# Altium project LPC4357_SDRAM-BGA.PrjPcb
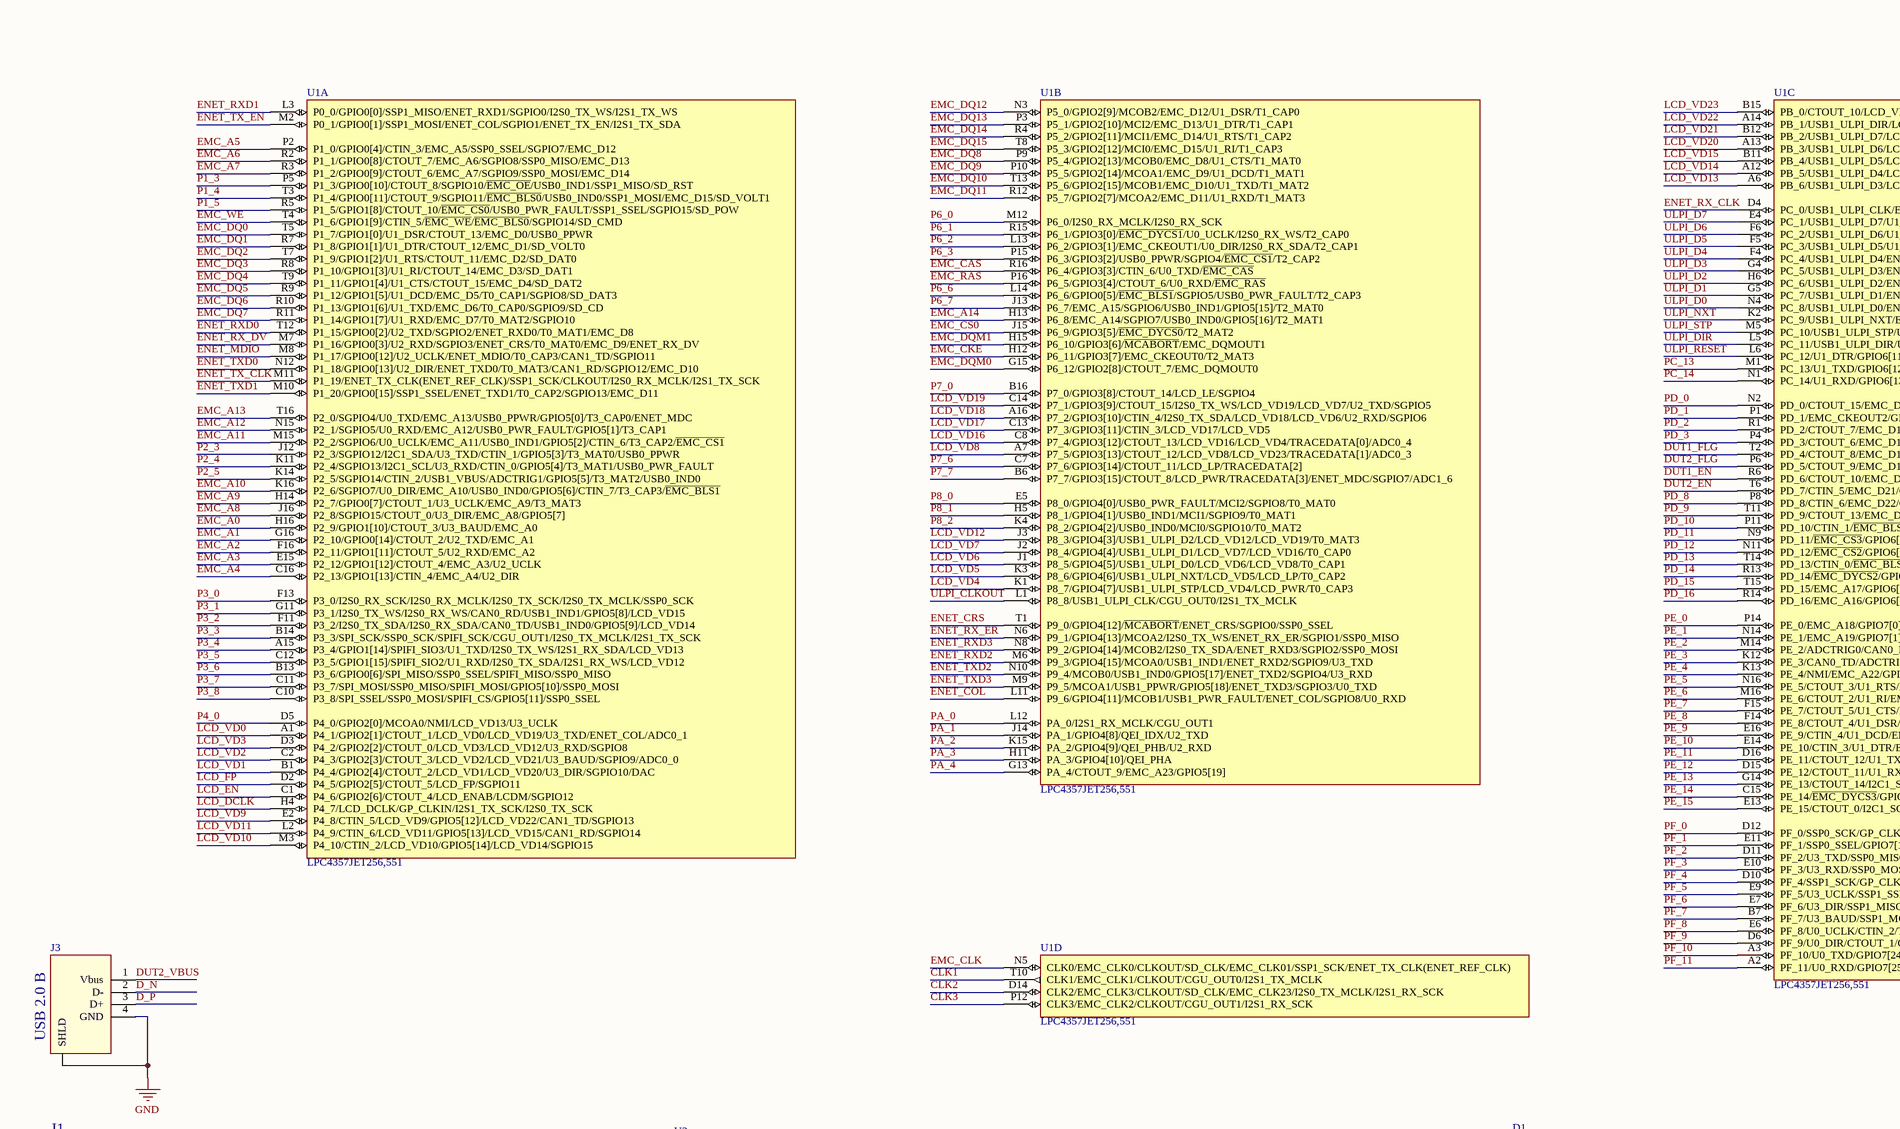
[diagram p0: LPC4357_SDRAM.SchDoc, top left]
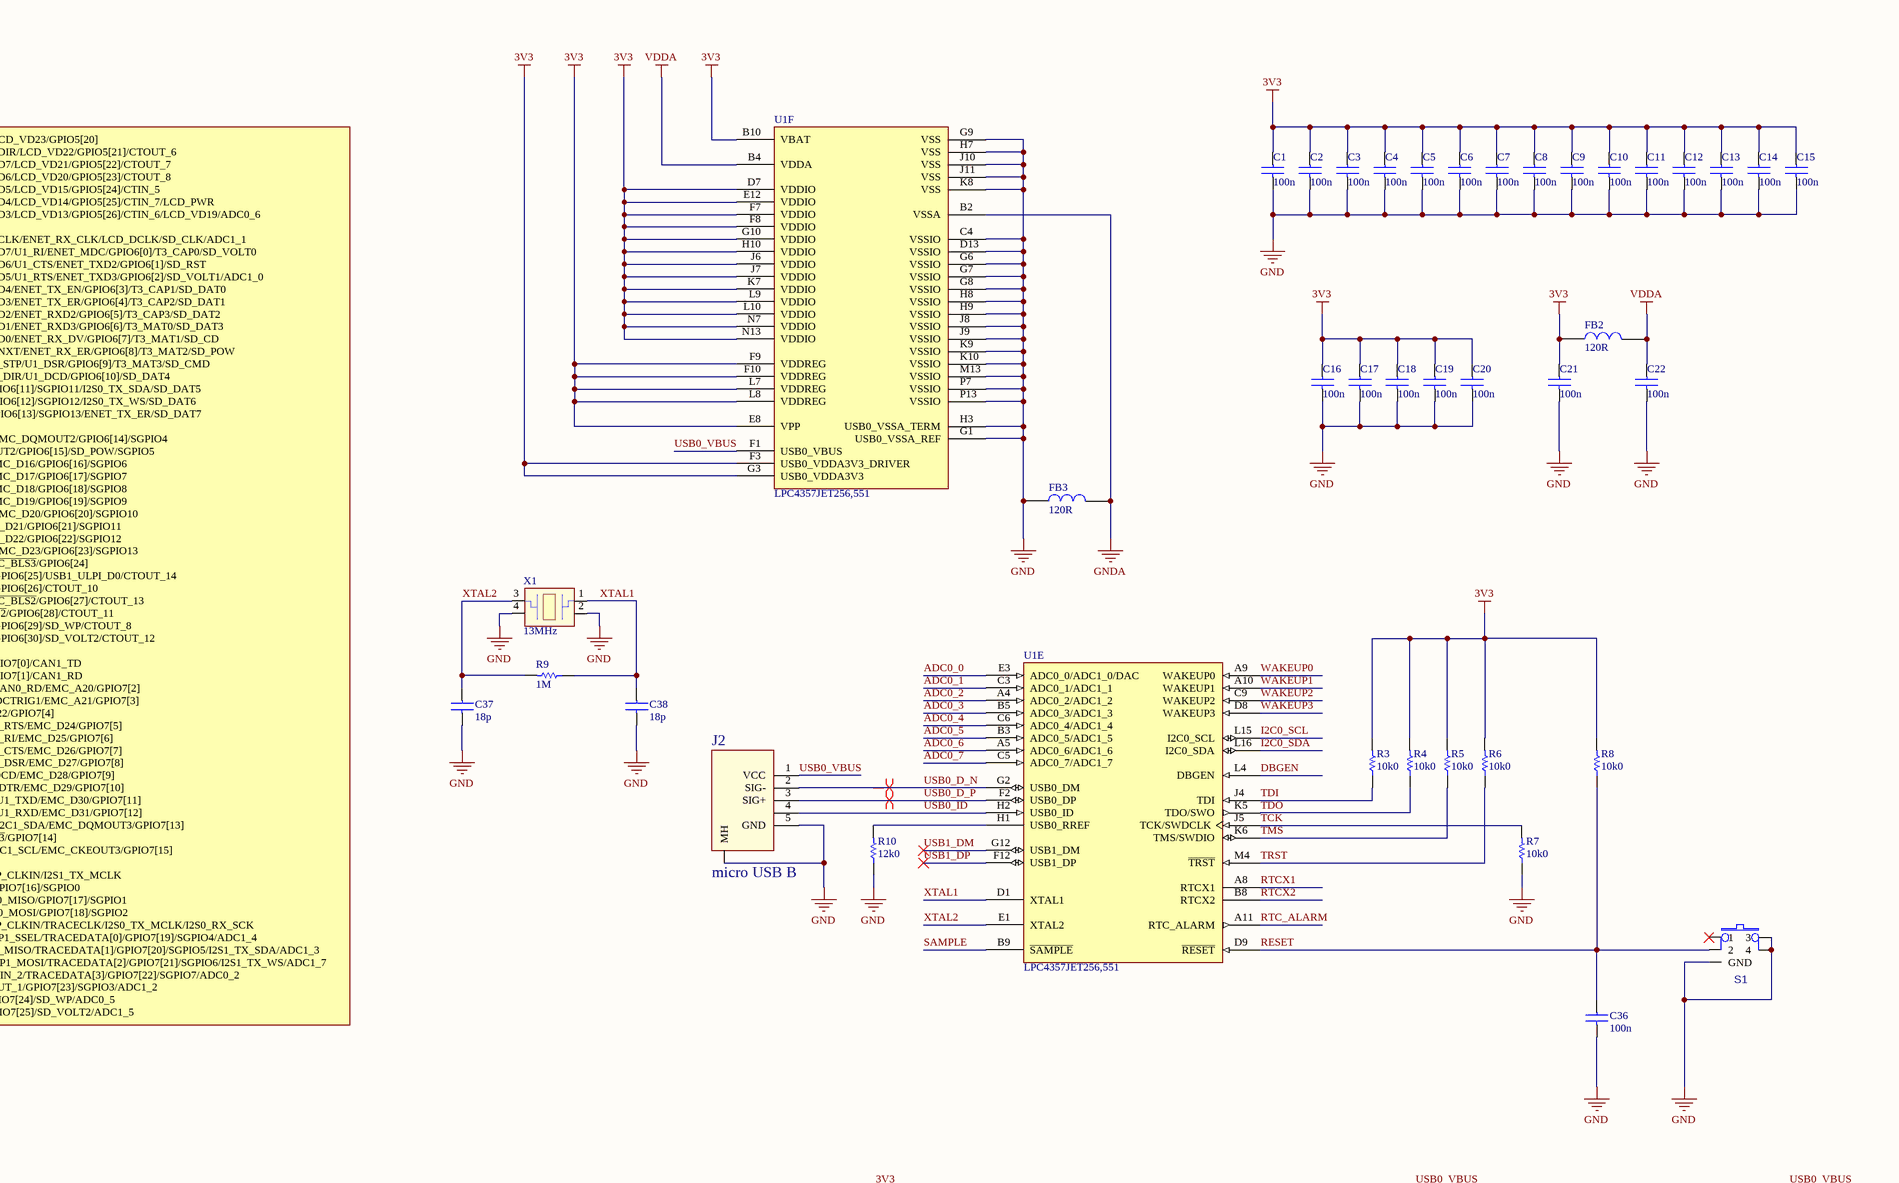
[diagram p1: LPC4357_SDRAM.SchDoc, top right]
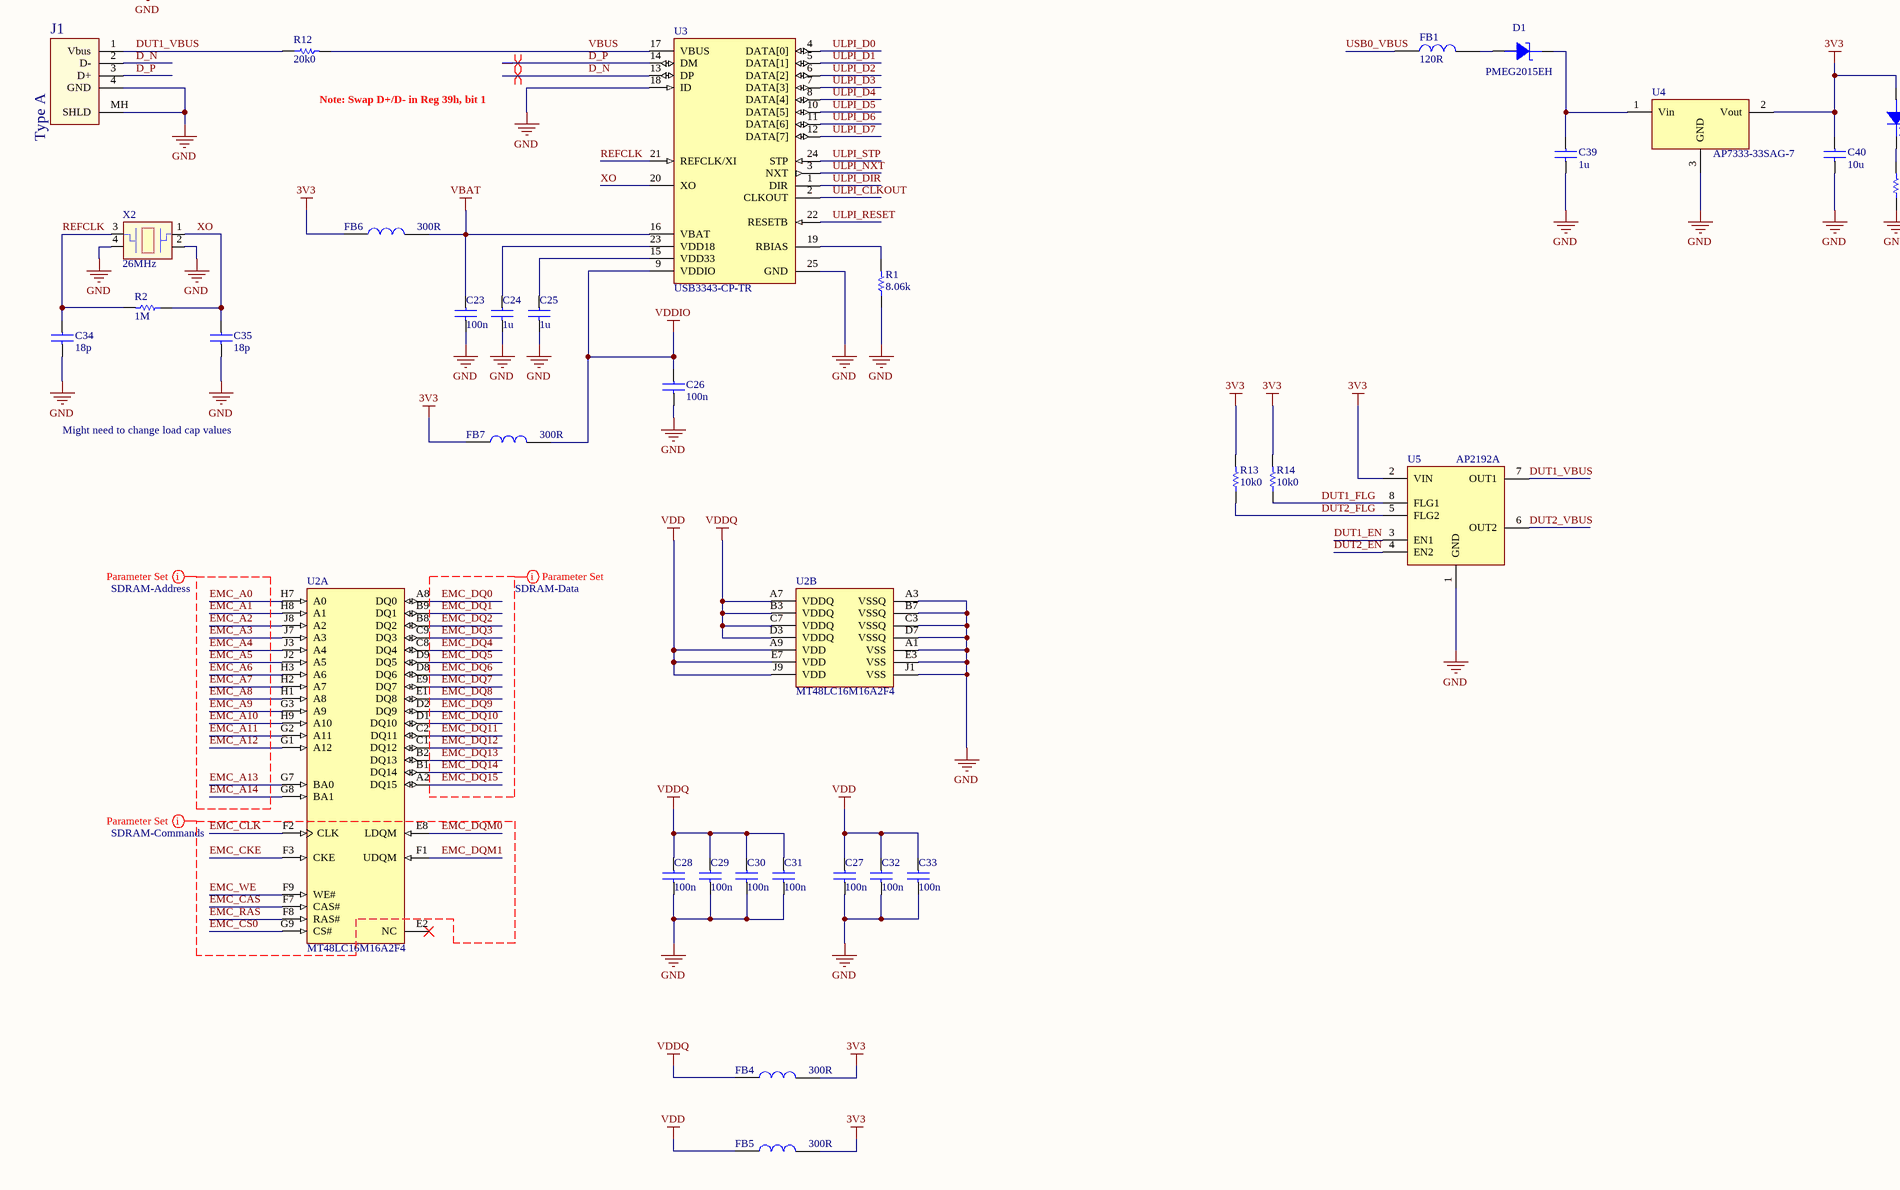
[diagram p2: LPC4357_SDRAM.SchDoc, bottom left]
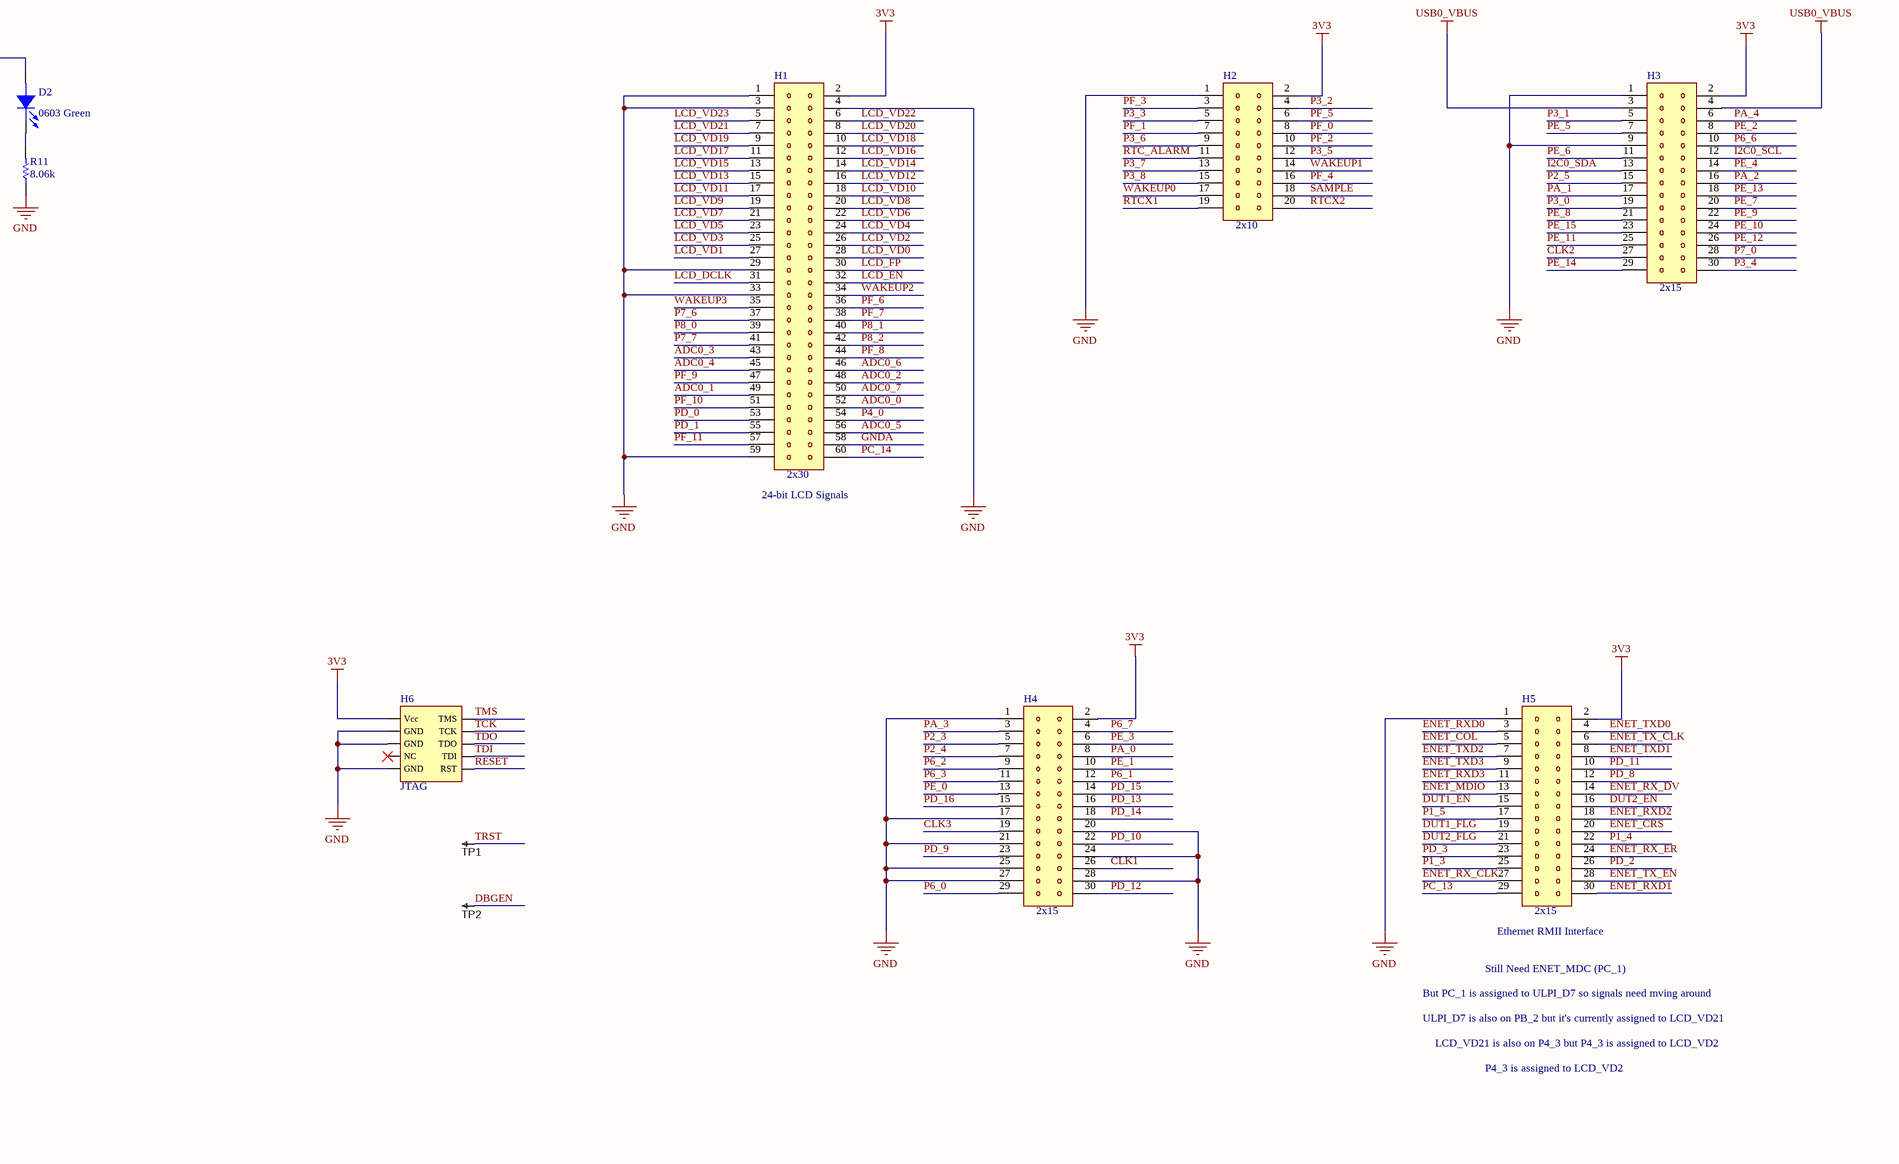
[diagram p3: LPC4357_SDRAM.SchDoc, bottom right]
1 sheet, 82 parts. Net scope: global (net labels, ports and power ports of the same name join across sheets).
Board file: LPC4357_SDRAM_v0.2.PcbDoc

## Sheet LPC4357_SDRAM.SchDoc
size D

### Parts
C1  100n  [C_0402_N]
C2  100n  [C_0402_N]
C3  100n  [C_0402_N]
C4  100n  [C_0402_N]
C5  100n  [C_0402_N]
C6  100n  [C_0402_N]
C7  100n  [C_0402_N]
C8  100n  [C_0402_N]
C9  100n  [C_0402_N]
C10  100n  [C_0402_N]
C11  100n  [C_0402_N]
C12  100n  [C_0402_N]
C13  100n  [C_0402_N]
C14  100n  [C_0402_N]
C15  100n  [C_0402_N]
C16  100n  [C_0402_N]
C17  100n  [C_0402_N]
C18  100n  [C_0402_N]
C19  100n  [C_0402_N]
C20  100n  [C_0402_N]
C21  100n  [C_0402_N]
C22  100n  [C_0402_N]
C23  100n  [C_0402_N]
C24  1u  [C_0402_N]
C25  1u  [C_0402_N]
C26  100n  [C_0402_N]
C27  100n  [C_0402_N]
C28  100n  [C_0402_N]
C29  100n  [C_0402_N]
C30  100n  [C_0402_N]
C31  100n  [C_0402_N]
C32  100n  [C_0402_N]
C33  100n  [C_0402_N]
C34  18p  [C_0402_N]
C35  18p  [C_0402_N]
C36  100n  [C_0402_N]
C37  18p  [C_0402_N]
C38  18p  [C_0402_N]
C39  1u  [C_0402_N]
C40  10u  [0603x55]
D1  PMEG2015EH  [SOD123F]
D2  0603 Green  [D_0603]
FB1  120R  [L_0603]
FB2  120R  [L_0603]
FB3  120R  [L_0603]
FB4  300R  [FB_0402-NIC]
FB5  300R  [FB_0402-NIC]
FB6  300R  [FB_0402-NIC]
FB7  300R  [FB_0402-NIC]
H1  2x30  [HDR_2x30_1.27mm]
H2  2x10  [HDR_2x10_1.27mm]
H3  2x15  [HDR_2x15_1.27mm]
H4  2x15  [HDR_2x15_1.27mm]
H5  2x15  [HDR_2x15_1.27mm]
H6  JTAG  [JTAG_FTSH-105-01-XXX-D-K]
J1  Type A  [USB_A_F_SIDE_REVERSE_TH]
J2  micro USB B  [10118194]
J3  USB 2.0 B  [USB_B_F_RA_TH]
R1  8.06k  [R_0402-N]
R2  1M  [R_0402-N]
R3  10k0  [R_0402-N]
R4  10k0  [R_0402-N]
R5  10k0  [R_0402-N]
R6  10k0  [R_0402-N]
R7  10k0  [R_0402-N]
R8  10k0  [R_0402-N]
R9  1M  [R_0402-N]
R10  12k0  [R_0402-N]
R11  8.06k  [R_0402-N]
R12  20k0  [R_0402-N]
R13  10k0  [R_0402-N]
R14  10k0  [R_0402-N]
S1  PTS840  [SW_PTS840]  (value not drawn)
TP1  TP_60mil-pad  [TP-R50]  (value not drawn)  (no BOM)
TP2  TP_60mil-pad  [TP-R50]  (value not drawn)  (no BOM)
U1  LPC4357JET256,551  [NXP-SOT740-2]  (parts A,B,C,D,E,F of 6)
U2  MT48LC16M16A2F4  [VFBGA54_8x8]  (parts A,B of 2)
U3  USB3343-CP-TR  [MCHP-QFN-24_A_V]
U4  AP7333-33SAG-7  [SOT23_N]
U5  AP2192A  [soic_8]
X1  13MHz  [XTAL_3.2mmx2.5mm]
X2  26MHz  [XTAL_2.0mmx1.6mm]

### Nets
3V3: C1.1 C2.1 C3.1 C4.1 C5.1 C6.1 C7.1 C8.1 C9.1 C10.1 C11.1 C12.1 C13.1 C14.1 C15.1 C16.1 C17.1 C18.1 C19.1 C20.1 C21.1 C40.1 D2.1(ANODE) FB2.1 FB4.2 FB5.2 FB6.1 FB7.1 H1.2 H2.2 H3.2 H4.2 H5.2 H6.1(Vcc) R3.2 R4.2 R5.2 R6.2 R8.2 R13.2 R14.2 U1.B10(VBAT) U1.D7(VDDIO) U1.E8(VPP) U1.E12(VDDIO) U1.F3(USB0_VDDA3V3_DRIVER) U1.F7(VDDIO) U1.F8(VDDIO) U1.F9(VDDREG) U1.F10(VDDREG) U1.G3(USB0_VDDA3V3) U1.G10(VDDIO) U1.H10(VDDIO) U1.J6(VDDIO) U1.J7(VDDIO) U1.K7(VDDIO) U1.L7(VDDREG) U1.L8(VDDREG) U1.L9(VDDIO) U1.L10(VDDIO) U1.N7(VDDIO) U1.N13(VDDIO) U4.2(Vout) U5.2(VIN)
GND: C1.2 C2.2 C3.2 C4.2 C5.2 C6.2 C7.2 C8.2 C9.2 C10.2 C11.2 C12.2 C13.2 C14.2 C15.2 C16.2 C17.2 C18.2 C19.2 C20.2 C21.2 C22.2 C23.2 C24.2 C25.2 C26.2 C27.2 C28.2 C29.2 C30.2 C31.2 C32.2 C33.2 C34.2 C35.2 C36.2 C37.2 C38.2 C39.2 C40.2 FB3.1 H1.1 H1.3 H1.4 H1.29 H1.33 H1.59 H2.1 H3.1 H3.9 H4.1 H4.17 H4.20 H4.21 H4.24 H4.25 H4.27 H4.28 H5.1 H6.3(GND) H6.5(GND) H6.9(GND) J1.4(GND) J1.MH(SHLD) J2.5(GND) J2.MH J3.4(GND) J3.SH(SHLD) R1.1 R7.1 R10.1 R11.1 S1.3 S1.4 S1.5(GND) U1.C4(VSSIO) U1.D13(VSSIO) U1.G1(USB0_VSSA_REF) U1.G6(VSSIO) U1.G7(VSSIO) U1.G8(VSSIO) U1.G9(VSS) U1.H3(USB0_VSSA_TERM) U1.H7(VSS) U1.H8(VSSIO) U1.H9(VSSIO) U1.J8(VSSIO) U1.J9(VSSIO) U1.J10(VSS) U1.J11(VSS) U1.K8(VSS) U1.K9(VSSIO) U1.K10(VSSIO) U1.M13(VSSIO) U1.P7(VSSIO) U1.P13(VSSIO) U2.A1(VSS) U2.A3(VSSQ) U2.B7(VSSQ) U2.C3(VSSQ) U2.D7(VSSQ) U2.E3(VSS) U2.J1(VSS) U3.18(ID) U3.25(GND) U4.3(GND) U5.1(GND) X1.2(GND) X1.4(GND) X2.2(GND) X2.4(GND)
GNDA: FB3.2 H1.58 U1.B2(VSSA)
USB0_VBUS: FB1.1 H3.3 H3.4 J2.1(VCC) U1.F1(USB0_VBUS)
VBAT: C23.1 FB6.2 U3.16(VBAT)
VDD: C27.1 C32.1 C33.1 FB5.1 U2.A9(VDD) U2.E7(VDD) U2.J9(VDD)
VDDA: C22.1 FB2.2 U1.B4(VDDA)
VDDIO: C26.1 FB7.2 U3.9(VDDIO)
VDDQ: C28.1 C29.1 C30.1 C31.1 FB4.1 U2.A7(VDDQ) U2.B3(VDDQ) U2.C7(VDDQ) U2.D3(VDDQ)
ADC0_0: H1.52 U1.E3(ADC0_0/ADC1_0/DAC)
ADC0_1: H1.49 U1.C3(ADC0_1/ADC1_1)
ADC0_2: H1.48 U1.A4(ADC0_2/ADC1_2)
ADC0_3: H1.43 U1.B5(ADC0_3/ADC1_3)
ADC0_4: H1.45 U1.C6(ADC0_4/ADC1_4)
ADC0_5: H1.56 U1.B3(ADC0_5/ADC1_5)
ADC0_6: H1.46 U1.A5(ADC0_6/ADC1_6)
ADC0_7: H1.50 U1.C5(ADC0_7/ADC1_7)
CLK1: H4.26 U1.T10(CLK1/EMC_CLK1/CLKOUT/CGU_OUT0/I2S1_TX_MCLK)
CLK2: H3.27 U1.D14(CLK2/EMC_CLK3/CLKOUT/SD_CLK/EMC_CLK23/I2S0_TX_MCLK/I2S1_RX_SCK)
CLK3: H4.19 U1.P12(CLK3/EMC_CLK2/CLKOUT/CGU_OUT1/I2S1_RX_SCK)
D_N: J1.2(D-) J3.2(D-) U3.13(DP)
D_P: J1.3(D+) J3.3(D+) U3.14(DM)
DBGEN: TP2.1 U1.L4(DBGEN)
DUT1_EN: H5.15 U1.R6(PD_6/CTOUT_10/EMC_D20/GPIO6[20]/SGPIO10) U5.3(EN1)
DUT1_FLG: H5.19 R14.1 U1.T2(PD_4/CTOUT_8/EMC_D18/GPIO6[18]/SGPIO8) U5.8(FLG1)
DUT1_VBUS: J1.1(Vbus) R12.1 U5.7(OUT1)
DUT2_EN: H5.16 U1.T6(PD_7/CTIN_5/EMC_D21/GPIO6[21]/SGPIO11) U5.4(EN2)
DUT2_FLG: H5.21 R13.1 U1.P6(PD_5/CTOUT_9/EMC_D19/GPIO6[19]/SGPIO9) U5.5(FLG2)
DUT2_VBUS: J3.1(Vbus) U5.6(OUT2)
EMC_A0: U1.H16(P2_9/GPIO1[10]/CTOUT_3/U3_BAUD/EMC_A0) U2.H7(A0)
EMC_A1: U1.G16(P2_10/GPIO0[14]/CTOUT_2/U2_TXD/EMC_A1) U2.H8(A1)
EMC_A2: U1.F16(P2_11/GPIO1[11]/CTOUT_5/U2_RXD/EMC_A2) U2.J8(A2)
EMC_A3: U1.E15(P2_12/GPIO1[12]/CTOUT_4/EMC_A3/U2_UCLK) U2.J7(A3)
EMC_A4: U1.C16(P2_13/GPIO1[13]/CTIN_4/EMC_A4/U2_DIR) U2.J3(A4)
EMC_A5: U1.P2(P1_0/GPIO0[4]/CTIN_3/EMC_A5/SSP0_SSEL/SGPIO7/EMC_D12) U2.J2(A5)
EMC_A6: U1.R2(P1_1/GPIO0[8]/CTOUT_7/EMC_A6/SGPIO8/SSP0_MISO/EMC_D13) U2.H3(A6)
EMC_A7: U1.R3(P1_2/GPIO0[9]/CTOUT_6/EMC_A7/SGPIO9/SSP0_MOSI/EMC_D14) U2.H2(A7)
EMC_A8: U1.J16(P2_8/SGPIO15/CTOUT_0/U3_DIR/EMC_A8/GPIO5[7]) U2.H1(A8)
EMC_A9: U1.H14(P2_7/GPIO0[7]/CTOUT_1/U3_UCLK/EMC_A9/T3_MAT3) U2.G3(A9)
EMC_A10: U1.K16(P2_6/SGPIO7/U0_DIR/EMC_A10/USB0_IND0/GPIO5[6]/CTIN_7/T3_CAP3/~{EMC_BLS1}) U2.H9(A10)
EMC_A11: U1.M15(P2_2/SGPIO6/U0_UCLK/EMC_A11/USB0_IND1/GPIO5[2]/CTIN_6/T3_CAP2/~{EMC_CS1}) U2.G2(A11)
EMC_A12: U1.N15(P2_1/SGPIO5/U0_RXD/EMC_A12/USB0_PWR_FAULT/GPIO5[1]/T3_CAP1) U2.G1(A12)
EMC_A13: U1.T16(P2_0/SGPIO4/U0_TXD/EMC_A13/USB0_PPWR/GPIO5[0]/T3_CAP0/ENET_MDC) U2.G7(BA0)
EMC_A14: U1.H13(P6_8/EMC_A14/SGPIO7/USB0_IND0/GPIO5[16]/T2_MAT1) U2.G8(BA1)
EMC_CAS: U1.R16(P6_4/GPIO3[3]/CTIN_6/U0_TXD/~{EMC_CAS}) U2.F7(CAS#)
EMC_CKE: U1.H12(P6_11/GPIO3[7]/EMC_CKEOUT0/T2_MAT3) U2.F3(CKE)
EMC_CLK: U1.N5(CLK0/EMC_CLK0/CLKOUT/SD_CLK/EMC_CLK01/SSP1_SCK/ENET_TX_CLK(ENET_REF_CLK)) U2.F2(CLK)
EMC_CS0: U1.J15(P6_9/GPIO3[5]/~{EMC_DYCS0}/T2_MAT2) U2.G9(CS#)
EMC_DQ0: U1.T5(P1_7/GPIO1[0]/U1_DSR/CTOUT_13/EMC_D0/USB0_PPWR) U2.A8(DQ0)
EMC_DQ1: U1.R7(P1_8/GPIO1[1]/U1_DTR/CTOUT_12/EMC_D1/SD_VOLT0) U2.B9(DQ1)
EMC_DQ2: U1.T7(P1_9/GPIO1[2]/U1_RTS/CTOUT_11/EMC_D2/SD_DAT0) U2.B8(DQ2)
EMC_DQ3: U1.R8(P1_10/GPIO1[3]/U1_RI/CTOUT_14/EMC_D3/SD_DAT1) U2.C9(DQ3)
EMC_DQ4: U1.T9(P1_11/GPIO1[4]/U1_CTS/CTOUT_15/EMC_D4/SD_DAT2) U2.C8(DQ4)
EMC_DQ5: U1.R9(P1_12/GPIO1[5]/U1_DCD/EMC_D5/T0_CAP1/SGPIO8/SD_DAT3) U2.D9(DQ5)
EMC_DQ6: U1.R10(P1_13/GPIO1[6]/U1_TXD/EMC_D6/T0_CAP0/SGPIO9/SD_CD) U2.D8(DQ6)
EMC_DQ7: U1.R11(P1_14/GPIO1[7]/U1_RXD/EMC_D7/T0_MAT2/SGPIO10) U2.E9(DQ7)
EMC_DQ8: U1.P9(P5_4/GPIO2[13]/MCOB0/EMC_D8/U1_CTS/T1_MAT0) U2.E1(DQ8)
EMC_DQ9: U1.P10(P5_5/GPIO2[14]/MCOA1/EMC_D9/U1_DCD/T1_MAT1) U2.D2(DQ9)
EMC_DQ10: U1.T13(P5_6/GPIO2[15]/MCOB1/EMC_D10/U1_TXD/T1_MAT2) U2.D1(DQ10)
EMC_DQ11: U1.R12(P5_7/GPIO2[7]/MCOA2/EMC_D11/U1_RXD/T1_MAT3) U2.C2(DQ11)
EMC_DQ12: U1.N3(P5_0/GPIO2[9]/MCOB2/EMC_D12/U1_DSR/T1_CAP0) U2.C1(DQ12)
EMC_DQ13: U1.P3(P5_1/GPIO2[10]/MCI2/EMC_D13/U1_DTR/T1_CAP1) U2.B2(DQ13)
EMC_DQ14: U1.R4(P5_2/GPIO2[11]/MCI1/EMC_D14/U1_RTS/T1_CAP2) U2.B1(DQ14)
EMC_DQ15: U1.T8(P5_3/GPIO2[12]/MCI0/EMC_D15/U1_RI/T1_CAP3) U2.A2(DQ15)
EMC_DQM0: U1.G15(P6_12/GPIO2[8]/CTOUT_7/EMC_DQMOUT0) U2.E8(LDQM)
EMC_DQM1: U1.H15(P6_10/GPIO3[6]/~{MCABORT}/EMC_DQMOUT1) U2.F1(UDQM)
EMC_RAS: U1.P16(P6_5/GPIO3[4]/CTOUT_6/U0_RXD/~{EMC_RAS}) U2.F8(RAS#)
EMC_WE: U1.T4(P1_6/GPIO1[9]/CTIN_5/~{EMC_WE}/~{EMC_BLS0}/SGPIO14/SD_CMD) U2.F9(WE#)
ENET_COL: H5.5 U1.L11(P9_6/GPIO4[11]/MCOB1/USB1_PWR_FAULT/ENET_COL/SGPIO8/U0_RXD)
ENET_CRS: H5.20 U1.T1(P9_0/GPIO4[12]/~{MCABORT}/ENET_CRS/SGPIO0/SSP0_SSEL)
ENET_MDIO: H5.13 U1.M8(P1_17/GPIO0[12]/U2_UCLK/ENET_MDIO/T0_CAP3/CAN1_TD/SGPIO11)
ENET_RX_CLK: H5.27 U1.D4(PC_0/USB1_ULPI_CLK/ENET_RX_CLK/LCD_DCLK/SD_CLK/ADC1_1)
ENET_RX_DV: H5.14 U1.M7(P1_16/GPIO0[3]/U2_RXD/SGPIO3/ENET_CRS/T0_MAT0/EMC_D9/ENET_RX_DV)
ENET_RX_ER: H5.24 U1.N6(P9_1/GPIO4[13]/MCOA2/I2S0_TX_WS/ENET_RX_ER/SGPIO1/SSP0_MISO)
ENET_RXD0: H5.3 U1.T12(P1_15/GPIO0[2]/U2_TXD/SGPIO2/ENET_RXD0/T0_MAT1/EMC_D8)
ENET_RXD1: H5.30 U1.L3(P0_0/GPIO0[0]/SSP1_MISO/ENET_RXD1/SGPIO0/I2S0_TX_WS/I2S1_TX_WS)
ENET_RXD2: H5.18 U1.M6(P9_3/GPIO4[15]/MCOA0/USB1_IND1/ENET_RXD2/SGPIO9/U3_TXD)
ENET_RXD3: H5.11 U1.N8(P9_2/GPIO4[14]/MCOB2/I2S0_TX_SDA/ENET_RXD3/SGPIO2/SSP0_MOSI)
ENET_TX_CLK: H5.6 U1.M11(P1_19/ENET_TX_CLK(ENET_REF_CLK)/SSP1_SCK/CLKOUT/I2S0_RX_MCLK/I2S1_TX_SCK)
ENET_TX_EN: H5.28 U1.M2(P0_1/GPIO0[1]/SSP1_MOSI/ENET_COL/SGPIO1/ENET_TX_EN/I2S1_TX_SDA)
ENET_TXD0: H5.4 U1.N12(P1_18/GPIO0[13]/U2_DIR/ENET_TXD0/T0_MAT3/CAN1_RD/SGPIO12/EMC_D10)
ENET_TXD1: H5.8 U1.M10(P1_20/GPIO0[15]/SSP1_SSEL/ENET_TXD1/T0_CAP2/SGPIO13/EMC_D11)
ENET_TXD2: H5.7 U1.N10(P9_4/MCOB0/USB1_IND0/GPIO5[17]/ENET_TXD2/SGPIO4/U3_RXD)
ENET_TXD3: H5.9 U1.M9(P9_5/MCOA1/USB1_PPWR/GPIO5[18]/ENET_TXD3/SGPIO3/U0_TXD)
I2C0_SCL: H3.12 U1.L15(I2C0_SCL)
I2C0_SDA: H3.13 U1.L16(I2C0_SDA)
LCD_DCLK: H1.31 U1.H4(P4_7/LCD_DCLK/GP_CLKIN/I2S1_TX_SCK/I2S0_TX_SCK)
LCD_EN: H1.32 U1.C1(P4_6/GPIO2[6]/CTOUT_4/LCD_ENAB/LCDM/SGPIO12)
LCD_FP: H1.30 U1.D2(P4_5/GPIO2[5]/CTOUT_5/LCD_FP/SGPIO11)
LCD_VD0: H1.28 U1.A1(P4_1/GPIO2[1]/CTOUT_1/LCD_VD0/LCD_VD19/U3_TXD/ENET_COL/ADC0_1)
LCD_VD1: H1.27 U1.B1(P4_4/GPIO2[4]/CTOUT_2/LCD_VD1/LCD_VD20/U3_DIR/SGPIO10/DAC)
LCD_VD2: H1.26 U1.C2(P4_3/GPIO2[3]/CTOUT_3/LCD_VD2/LCD_VD21/U3_BAUD/SGPIO9/ADC0_0)
LCD_VD3: H1.25 U1.D3(P4_2/GPIO2[2]/CTOUT_0/LCD_VD3/LCD_VD12/U3_RXD/SGPIO8)
LCD_VD4: H1.24 U1.K1(P8_7/GPIO4[7]/USB1_ULPI_STP/LCD_VD4/LCD_PWR/T0_CAP3)
LCD_VD5: H1.23 U1.K3(P8_6/GPIO4[6]/USB1_ULPI_NXT/LCD_VD5/LCD_LP/T0_CAP2)
LCD_VD6: H1.22 U1.J1(P8_5/GPIO4[5]/USB1_ULPI_D0/LCD_VD6/LCD_VD8/T0_CAP1)
LCD_VD7: H1.21 U1.J2(P8_4/GPIO4[4]/USB1_ULPI_D1/LCD_VD7/LCD_VD16/T0_CAP0)
LCD_VD8: H1.20 U1.A7(P7_5/GPIO3[13]/CTOUT_12/LCD_VD8/LCD_VD23/TRACEDATA[1]/ADC0_3)
LCD_VD9: H1.19 U1.E2(P4_8/CTIN_5/LCD_VD9/GPIO5[12]/LCD_VD22/CAN1_TD/SGPIO13)
LCD_VD10: H1.18 U1.M3(P4_10/CTIN_2/LCD_VD10/GPIO5[14]/LCD_VD14/SGPIO15)
LCD_VD11: H1.17 U1.L2(P4_9/CTIN_6/LCD_VD11/GPIO5[13]/LCD_VD15/CAN1_RD/SGPIO14)
LCD_VD12: H1.16 U1.J3(P8_3/GPIO4[3]/USB1_ULPI_D2/LCD_VD12/LCD_VD19/T0_MAT3)
LCD_VD13: H1.15 U1.A6(PB_6/USB1_ULPI_D3/LCD_VD13/GPIO5[26]/CTIN_6/LCD_VD19/ADC0_6)
LCD_VD14: H1.14 U1.A12(PB_5/USB1_ULPI_D4/LCD_VD14/GPIO5[25]/CTIN_7/LCD_PWR)
LCD_VD15: H1.13 U1.B11(PB_4/USB1_ULPI_D5/LCD_VD15/GPIO5[24]/CTIN_5)
LCD_VD16: H1.12 U1.C8(P7_4/GPIO3[12]/CTOUT_13/LCD_VD16/LCD_VD4/TRACEDATA[0]/ADC0_4)
LCD_VD17: H1.11 U1.C13(P7_3/GPIO3[11]/CTIN_3/LCD_VD17/LCD_VD5)
LCD_VD18: H1.10 U1.A16(P7_2/GPIO3[10]/CTIN_4/I2S0_TX_SDA/LCD_VD18/LCD_VD6/U2_RXD/SGPIO6)
LCD_VD19: H1.9 U1.C14(P7_1/GPIO3[9]/CTOUT_15/I2S0_TX_WS/LCD_VD19/LCD_VD7/U2_TXD/SGPIO5)
LCD_VD20: H1.8 U1.A13(PB_3/USB1_ULPI_D6/LCD_VD20/GPIO5[23]/CTOUT_8)
LCD_VD21: H1.7 U1.B12(PB_2/USB1_ULPI_D7/LCD_VD21/GPIO5[22]/CTOUT_7)
LCD_VD22: H1.6 U1.A14(PB_1/USB1_ULPI_DIR/LCD_VD22/GPIO5[21]/CTOUT_6)
LCD_VD23: H1.5 U1.B15(PB_0/CTOUT_10/LCD_VD23/GPIO5[20])
P1_3: H5.25 U1.P5(P1_3/GPIO0[10]/CTOUT_8/SGPIO10/~{EMC_OE}/USB0_IND1/SSP1_MISO/SD_RST)
P1_4: H5.22 U1.T3(P1_4/GPIO0[11]/CTOUT_9/SGPIO11/~{EMC_BLS0}/USB0_IND0/SSP1_MOSI/EMC_D15/SD_VOLT1)
P1_5: H5.17 U1.R5(P1_5/GPIO1[8]/CTOUT_10/~{EMC_CS0}/USB0_PWR_FAULT/SSP1_SSEL/SGPIO15/SD_POW)
P2_3: H4.5 U1.J12(P2_3/SGPIO12/I2C1_SDA/U3_TXD/CTIN_1/GPIO5[3]/T3_MAT0/USB0_PPWR)
P2_4: H4.7 U1.K11(P2_4/SGPIO13/I2C1_SCL/U3_RXD/CTIN_0/GPIO5[4]/T3_MAT1/USB0_PWR_FAULT)
P2_5: H3.15 U1.K14(P2_5/SGPIO14/CTIN_2/USB1_VBUS/ADCTRIG1/GPIO5[5]/T3_MAT2/USB0_IND0)
P3_0: H3.19 U1.F13(P3_0/I2S0_RX_SCK/I2S0_RX_MCLK/I2S0_TX_SCK/I2S0_TX_MCLK/SSP0_SCK)
P3_1: H3.5 U1.G11(P3_1/I2S0_TX_WS/I2S0_RX_WS/CAN0_RD/USB1_IND1/GPIO5[8]/LCD_VD15)
P3_2: H2.4 U1.F11(P3_2/I2S0_TX_SDA/I2S0_RX_SDA/CAN0_TD/USB1_IND0/GPIO5[9]/LCD_VD14)
P3_3: H2.5 U1.B14(P3_3/SPI_SCK/SSP0_SCK/SPIFI_SCK/CGU_OUT1/I2S0_TX_MCLK/I2S1_TX_SCK)
P3_4: H3.30 U1.A15(P3_4/GPIO1[14]/SPIFI_SIO3/U1_TXD/I2S0_TX_WS/I2S1_RX_SDA/LCD_VD13)
P3_5: H2.12 U1.C12(P3_5/GPIO1[15]/SPIFI_SIO2/U1_RXD/I2S0_TX_SDA/I2S1_RX_WS/LCD_VD12)
P3_6: H2.9 U1.B13(P3_6/GPIO0[6]/SPI_MISO/SSP0_SSEL/SPIFI_MISO/SSP0_MISO)
P3_7: H2.13 U1.C11(P3_7/SPI_MOSI/SSP0_MISO/SPIFI_MOSI/GPIO5[10]/SSP0_MOSI)
P3_8: H2.15 U1.C10(P3_8/SPI_SSEL/SSP0_MOSI/SPIFI_CS/GPIO5[11]/SSP0_SSEL)
P4_0: H1.54 U1.D5(P4_0/GPIO2[0]/MCOA0/NMI/LCD_VD13/U3_UCLK)
P6_0: H4.29 U1.M12(P6_0/I2S0_RX_MCLK/I2S0_RX_SCK)
P6_1: H4.12 U1.R15(P6_1/GPIO3[0]/~{EMC_DYCS1}/U0_UCLK/I2S0_RX_WS/T2_CAP0)
P6_2: H4.9 U1.L13(P6_2/GPIO3[1]/EMC_CKEOUT1/U0_DIR/I2S0_RX_SDA/T2_CAP1)
P6_3: H4.11 U1.P15(P6_3/GPIO3[2]/USB0_PPWR/SGPIO4/~{EMC_CS1}/T2_CAP2)
P6_6: H3.10 U1.L14(P6_6/GPIO0[5]/~{EMC_BLS1}/SGPIO5/USB0_PWR_FAULT/T2_CAP3)
P6_7: H4.4 U1.J13(P6_7/EMC_A15/SGPIO6/USB0_IND1/GPIO5[15]/T2_MAT0)
P7_0: H3.28 U1.B16(P7_0/GPIO3[8]/CTOUT_14/LCD_LE/SGPIO4)
P7_6: H1.37 U1.C7(P7_6/GPIO3[14]/CTOUT_11/LCD_LP/TRACEDATA[2])
P7_7: H1.41 U1.B6(P7_7/GPIO3[15]/CTOUT_8/LCD_PWR/TRACEDATA[3]/ENET_MDC/SGPIO7/ADC1_6)
P8_0: H1.39 U1.E5(P8_0/GPIO4[0]/USB0_PWR_FAULT/MCI2/SGPIO8/T0_MAT0)
P8_1: H1.40 U1.H5(P8_1/GPIO4[1]/USB0_IND1/MCI1/SGPIO9/T0_MAT1)
P8_2: H1.42 U1.K4(P8_2/GPIO4[2]/USB0_IND0/MCI0/SGPIO10/T0_MAT2)
PA_0: H4.8 U1.L12(PA_0/I2S1_RX_MCLK/CGU_OUT1)
PA_1: H3.17 U1.J14(PA_1/GPIO4[8]/QEI_IDX/U2_TXD)
PA_2: H3.16 U1.K15(PA_2/GPIO4[9]/QEI_PHB/U2_RXD)
PA_3: H4.3 U1.H11(PA_3/GPIO4[10]/QEI_PHA)
PA_4: H3.6 U1.G13(PA_4/CTOUT_9/EMC_A23/GPIO5[19])
PC_13: H5.29 U1.M1(PC_13/U1_TXD/GPIO6[12]/SGPIO12/I2S0_TX_WS/SD_DAT6)
PC_14: H1.60 U1.N1(PC_14/U1_RXD/GPIO6[13]/SGPIO13/ENET_TX_ER/SD_DAT7)
PD_0: H1.53 U1.N2(PD_0/CTOUT_15/EMC_DQMOUT2/GPIO6[14]/SGPIO4)
PD_1: H1.55 U1.P1(PD_1/EMC_CKEOUT2/GPIO6[15]/SD_POW/SGPIO5)
PD_2: H5.26 U1.R1(PD_2/CTOUT_7/EMC_D16/GPIO6[16]/SGPIO6)
PD_3: H5.23 U1.P4(PD_3/CTOUT_6/EMC_D17/GPIO6[17]/SGPIO7)
PD_8: H5.12 U1.P8(PD_8/CTIN_6/EMC_D22/GPIO6[22]/SGPIO12)
PD_9: H4.23 U1.T11(PD_9/CTOUT_13/EMC_D23/GPIO6[23]/SGPIO13)
PD_10: H4.22 U1.P11(PD_10/CTIN_1/~{EMC_BLS3}/GPIO6[24])
PD_11: H5.10 U1.N9(PD_11/~{EMC_CS3}/GPIO6[25]/USB1_ULPI_D0/CTOUT_14)
PD_12: H4.30 U1.N11(PD_12/~{EMC_CS2}/GPIO6[26]/CTOUT_10)
PD_13: H4.16 U1.T14(PD_13/CTIN_0/~{EMC_BLS2}/GPIO6[27]/CTOUT_13)
PD_14: H4.18 U1.R13(PD_14/~{EMC_DYCS2}/GPIO6[28]/CTOUT_11)
PD_15: H4.14 U1.T15(PD_15/EMC_A17/GPIO6[29]/SD_WP/CTOUT_8)
PD_16: H4.15 U1.R14(PD_16/EMC_A16/GPIO6[30]/SD_VOLT2/CTOUT_12)
PE_0: H4.13 U1.P14(PE_0/EMC_A18/GPIO7[0]/CAN1_TD)
PE_1: H4.10 U1.N14(PE_1/EMC_A19/GPIO7[1]/CAN1_RD)
PE_2: H3.8 U1.M14(PE_2/ADCTRIG0/CAN0_RD/EMC_A20/GPIO7[2])
PE_3: H4.6 U1.K12(PE_3/CAN0_TD/ADCTRIG1/EMC_A21/GPIO7[3])
PE_4: H3.14 U1.K13(PE_4/NMI/EMC_A22/GPIO7[4])
PE_5: H3.7 U1.N16(PE_5/CTOUT_3/U1_RTS/EMC_D24/GPIO7[5])
PE_6: H3.11 U1.M16(PE_6/CTOUT_2/U1_RI/EMC_D25/GPIO7[6])
PE_7: H3.20 U1.F15(PE_7/CTOUT_5/U1_CTS/EMC_D26/GPIO7[7])
PE_8: H3.21 U1.F14(PE_8/CTOUT_4/U1_DSR/EMC_D27/GPIO7[8])
PE_9: H3.22 U1.E16(PE_9/CTIN_4/U1_DCD/EMC_D28/GPIO7[9])
PE_10: H3.24 U1.E14(PE_10/CTIN_3/U1_DTR/EMC_D29/GPIO7[10])
PE_11: H3.25 U1.D16(PE_11/CTOUT_12/U1_TXD/EMC_D30/GPIO7[11])
PE_12: H3.26 U1.D15(PE_12/CTOUT_11/U1_RXD/EMC_D31/GPIO7[12])
PE_13: H3.18 U1.G14(PE_13/CTOUT_14/I2C1_SDA/EMC_DQMOUT3/GPIO7[13])
PE_14: H3.29 U1.C15(PE_14/~{EMC_DYCS3}/GPIO7[14])
PE_15: H3.23 U1.E13(PE_15/CTOUT_0/I2C1_SCL/EMC_CKEOUT3/GPIO7[15])
PF_0: H2.8 U1.D12(PF_0/SSP0_SCK/GP_CLKIN/I2S1_TX_MCLK)
PF_1: H2.7 U1.E11(PF_1/SSP0_SSEL/GPIO7[16]/SGPIO0)
PF_2: H2.10 U1.D11(PF_2/U3_TXD/SSP0_MISO/GPIO7[17]/SGPIO1)
PF_3: H2.3 U1.E10(PF_3/U3_RXD/SSP0_MOSI/GPIO7[18]/SGPIO2)
PF_4: H2.16 U1.D10(PF_4/SSP1_SCK/GP_CLKIN/TRACECLK/I2S0_TX_MCLK/I2S0_RX_SCK)
PF_5: H2.6 U1.E9(PF_5/U3_UCLK/SSP1_SSEL/TRACEDATA[0]/GPIO7[19]/SGPIO4/ADC1_4)
PF_6: H1.36 U1.E7(PF_6/U3_DIR/SSP1_MISO/TRACEDATA[1]/GPIO7[20]/SGPIO5/I2S1_TX_SDA/ADC1_3)
PF_7: H1.38 U1.B7(PF_7/U3_BAUD/SSP1_MOSI/TRACEDATA[2]/GPIO7[21]/SGPIO6/I2S1_TX_WS/ADC1_7)
PF_8: H1.44 U1.E6(PF_8/U0_UCLK/CTIN_2/TRACEDATA[3]/GPIO7[22]/SGPIO7/ADC0_2)
PF_9: H1.47 U1.D6(PF_9/U0_DIR/CTOUT_1/GPIO7[23]/SGPIO3/ADC1_2)
PF_10: H1.51 U1.A3(PF_10/U0_TXD/GPIO7[24]/SD_WP/ADC0_5)
PF_11: H1.57 U1.A2(PF_11/U0_RXD/GPIO7[25]/SD_VOLT2/ADC1_5)
REFCLK: C34.1 R2.2 U3.21(REFCLK/XI) X2.3
RESET: C36.1 H6.10(RST) R8.1 S1.2 U1.D9(~{RESET})
RTC_ALARM: H2.11 U1.A11(RTC_ALARM)
RTCX1: H2.19 U1.A8(RTCX1)
RTCX2: H2.20 U1.B8(RTCX2)
SAMPLE: H2.18 U1.B9(~{SAMPLE})
TCK: H6.4(TCK) R7.2 U1.J5(TCK/SWDCLK)
TDI: H6.8(TDI) R3.1 U1.J4(TDI)
TDO: H6.6(TDO) R4.1 U1.K5(TDO/SWO)
TMS: H6.2(TMS) R5.1 U1.K6(TMS/SWDIO)
TRST: R6.1 TP1.1 U1.M4(~{TRST})
ULPI_CLKOUT: U1.L1(P8_8/USB1_ULPI_CLK/CGU_OUT0/I2S1_TX_MCLK) U3.2(CLKOUT)
ULPI_D0: U1.N4(PC_8/USB1_ULPI_D0/ENET_RX_DV/GPIO6[7]/T3_MAT1/SD_CD) U3.4(DATA[0])
ULPI_D1: U1.G5(PC_7/USB1_ULPI_D1/ENET_RXD3/GPIO6[6]/T3_MAT0/SD_DAT3) U3.5(DATA[1])
ULPI_D2: U1.H6(PC_6/USB1_ULPI_D2/ENET_RXD2/GPIO6[5]/T3_CAP3/SD_DAT2) U3.6(DATA[2])
ULPI_D3: U1.G4(PC_5/USB1_ULPI_D3/ENET_TX_ER/GPIO6[4]/T3_CAP2/SD_DAT1) U3.7(DATA[3])
ULPI_D4: U1.F4(PC_4/USB1_ULPI_D4/ENET_TX_EN/GPIO6[3]/T3_CAP1/SD_DAT0) U3.8(DATA[4])
ULPI_D5: U1.F5(PC_3/USB1_ULPI_D5/U1_RTS/ENET_TXD3/GPIO6[2]/SD_VOLT1/ADC1_0) U3.10(DATA[5])
ULPI_D6: U1.F6(PC_2/USB1_ULPI_D6/U1_CTS/ENET_TXD2/GPIO6[1]/SD_RST) U3.11(DATA[6])
ULPI_D7: U1.E4(PC_1/USB1_ULPI_D7/U1_RI/ENET_MDC/GPIO6[0]/T3_CAP0/SD_VOLT0) U3.12(DATA[7])
ULPI_DIR: U1.L5(PC_11/USB1_ULPI_DIR/U1_DCD/GPIO6[10]/SD_DAT4) U3.1(DIR)
ULPI_NXT: U1.K2(PC_9/USB1_ULPI_NXT/ENET_RX_ER/GPIO6[8]/T3_MAT2/SD_POW) U3.3(NXT)
ULPI_RESET: U1.L6(PC_12/U1_DTR/GPIO6[11]/SGPIO11/I2S0_TX_SDA/SD_DAT5) U3.22(RESETB)
ULPI_STP: U1.M5(PC_10/USB1_ULPI_STP/U1_DSR/GPIO6[9]/T3_MAT3/SD_CMD) U3.24(STP)
USB0_D_N: J2.2(SIG-) U1.G2(USB0_DM)
USB0_D_P: J2.3(SIG+) U1.F2(USB0_DP)
USB0_ID: J2.4 U1.H2(USB0_ID)
USB1_DM: U1.G12(USB1_DM)
USB1_DP: U1.F12(USB1_DP)
VBUS: R12.2 U3.17(VBUS)
WAKEUP0: H2.17 U1.A9(WAKEUP0)
WAKEUP1: H2.14 U1.A10(WAKEUP1)
WAKEUP2: H1.34 U1.C9(WAKEUP2)
WAKEUP3: H1.35 U1.D8(WAKEUP3)
XO: C35.1 R2.1 U3.20(XO) X2.1
XTAL1: C38.1 R9.1 U1.D1(XTAL1) X1.1
XTAL2: C37.1 R9.2 U1.E1(XTAL2) X1.3
NetC24_1: C24.1 U3.23(VDD18)
NetC25_1: C25.1 U3.15(VDD33)
NetC39_1: C39.1 D1.2(K) U4.1(Vin)
NetD1_1: D1.1(A) FB1.2
NetD2_2: D2.2(CATHODE) R11.2
NetR1_2: R1.2 U3.19(RBIAS)
NetR10_2: R10.2 U1.H1(USB0_RREF)

Not connected (* = marked no-connect by the designer): H6 7(NC)*; S1 1*; U2 E2(NC)*

### Layout directives
net class SDRAM-Address: EMC_A0, EMC_A1, EMC_A2, EMC_A3, EMC_A4, EMC_A5, EMC_A6, EMC_A7, EMC_A8, EMC_A9, EMC_A10, EMC_A11, EMC_A12, EMC_A13, EMC_A14
net class SDRAM-Data: EMC_DQ0, EMC_DQ1, EMC_DQ2, EMC_DQ3, EMC_DQ4, EMC_DQ5, EMC_DQ6, EMC_DQ7, EMC_DQ8, EMC_DQ9, EMC_DQ10, EMC_DQ11, EMC_DQ12, EMC_DQ13, EMC_DQ14, EMC_DQ15
net class SDRAM-Commands: EMC_CAS, EMC_CKE, EMC_CLK, EMC_CS0, EMC_DQM0, EMC_DQM1, EMC_RAS, EMC_WE
differential pair: D_N, D_P, USB0_D_N, USB0_D_P

### Notes on the sheet
- (near R12) Note: Swap D+/D- in Reg 39h, bit 1
- Might need to change load cap values
- (near H1) 24-bit LCD Signals
- Still Need ENET_MDC (PC_1)
- (near H5) Ethernet RMII Interface
- But PC_1 is assigned to ULPI_D7 so signals need mving around
- ULPI_D7 is also on PB_2 but it's currently assigned to LCD_VD21
- LCD_VD21 is also on P4_3 but P4_3 is assigned to LCD_VD2
- P4_3 is assigned to LCD_VD2
- Title
- Size:
- Date:
- File:
- D
- Number:
- Time:
- Revision:
- Sheet
- of

### Library data of the parts
C1-C23 C26-C33 C36 = C_100n_16V_10_0402_NIC: Cap, Chip, 100nF, 16V, +/-10%, X7R, 0402; Manufacturer: NIC; Manufacturer_No: NMC0402X7R104K16TRPF; PB-free: Yes; HelpURL: http://www.niccomp.com/catalog/nmc3.pdf; IOT: IOT-0301; Supplier 1: Future Electronics; Supplier Part Number 1: NMC0402X7R104K16TRPF-REEL
C24 C25 C39 = C_1u_10V_10_0402_NIC: Cap, Chip, 1uF, 10V, 10%, X5R, 0402; Manufacturer: NIC; Manufacturer_No: NMC0402X5R105K10TRPF; PB-free: Yes; IOT: IOT-; Dist_No: NMC0402X5R105K10TRPF; Distributor: Avnet; HelpURL: http://www.niccomp.com/catalog/nmc2.pdf; Price: 0.0056; Supplier 1: Future Electronics; Supplier Part Number 1: NMC0402X5R105K10TRPF-CUTT
C34 C35 C37 C38 = C_18p_25V_10_0402_NIC: Cap, Chip, 18pF, 25V, 10%, NPO 0402; Manufacturer: NIC; Manufacturer_No: NMC0402NPO180J25TRPF; PB-free: Yes; HelpURL: http://www.niccomp.com/catalog/nmc1.pdf; IOT: IOT-0056
C40 = C_10u_10V_10_0603_NIC: Cap, Chip, 10uF, 10V, ± 15%, X5R, 0603; Manufacturer: NIC; Manufacturer_No: NMC0603X5R106K10TRPF; PB-free: Yes; Dist_No: NMC0603X5R106K10TRPF; Distributor: NIC; HelpURL: http://www.niccomp.com/catalog/nmc1.pdf; Price: 0.02; IOT: IOT-0719
D1 = D_PMEG2015EH_20V_1A5_SOT123F: Diode, Schottky Rectifier, 20V, 1.5A, SOT123F; Manufacturer: NXP Semiconductors; Manufacturer_No: PMEG2015EH T/R; Dist_No: 568-4116-1-ND; PB-free: Yes; Voltage: 20V; Distributor: DIGIKEY; HelpURL: http://www.nxp.com/acrobat_download/datasheets/PMEG2015EH_EJ_2.pdf; Price: 0.46000
D2 = D_LED-0603_LTST-C190KGKT: 0603 LED, Green; Manufacturer: Lite-on; PB-free: Yes; Distributor: Avnet; Dist_No: LTST-C190KGKT; Manufacturer_No: LTST-C190KGKT; HelpURL: http://optoelectronics.liteon.com/upload/download/DS22-2000-074/S_110_LTST-C190KGKT.pdf; Price: 0.0376; IOT: IOT-0171; Supplier 1: Digi-Key; Supplier Part Number 1: 160-1435-1-ND
FB1-FB3 = FB_120R_0603_NIC: Ferrite bead,120 ohm@100MHz,0.30 ohm @DC, 500mA, 0603; Manufacturer: NIC; Manufacturer_No: NCB0603R121TR060F; HelpURL: http://www.niccomp.com/catalog/ncb.pdf; Value: 120R; IOT: IOT-0083
FB4-FB7 = FB_300R_0402_NIC: Ferrite bead,300 ohm@100MHz,0.15 ohm @DC, 1A, 0402; Manufacturer: NIC; Manufacturer_No: NCB-H0402P301TR100F; Distributor: NIC; Price: 0.01; HelpURL: http://www.niccomp.com/catalog/ncbh.pdf; Dist_No: NCB-H0402P301TR100F; Value: 300R; IOT: IOT-0720; Supplier 1: Digi-Key; Supplier Part Number 1: 490-5256-2-ND
H1 = JP_2x30_1.27mm: CONN, Header, 2x30, TH, 1.27mm; Manufacturer: Shenzhen Cankemeng; Manufacturer_No: 220-1S-2*30; Dist_No: C124402; PB-free: Yes; Distributor: LCSC; Price: 0.32; HelpURL: https://lcsc.com/product-detail/Pin-Header-Female-Header_Shenzhen-Cankemeng-Female-header-2-30P-1-27mm-Straight-line_C124402.html; ComponentLink1Description: Datasheet; ComponentLink1URL: https://datasheet.lcsc.com/szlcsc/Shenzhen-Cankemeng-Female-header-2-30P-1-27mm-Straight-line_C124402.pdf
H2 = JP_2x10_1.27mm: CONN, Header, 2x10, TH, 1.27mm; PB-free: Yes; Price: 0.32
H3-H5 = JP_2x15_1.27mm: CONN, Header, 2x15, TH, 1.27mm; PB-free: Yes; Distributor: LCSC; Price: 0.32; ComponentLink1Description: Datasheet; ComponentLink1URL: https://datasheet.lcsc.com/szlcsc/Shenzhen-Cankemeng-Female-header-2-30P-1-27mm-Straight-line_C124402.pdf
H6 = JP_JTAG-FTSH_1.27: CONN, Header 2x5, TH, 1.27mm; Manufacturer: Samtec; Manufacturer_No: FTSH-105-01-L-D-K; PB-free: Yes; Distributor: Heilind; Dist_No: FTSH-105-01-L-D-K; Price: $2.00; IOT: *
J1 = J_USB_A_Rotate_Reverse_TH: USB, Type A, Side Insert, Revese PinoutRA; Manufacturer: Jing Extension; Manufacturer_No: C39452; PB-free: Yes; Distributor: LCSC; Dist_No: C39452; Price: 0.05; HelpURL: https://datasheet.lcsc.com/szlcsc/Jing-Extension-of-the-Electronic-Co-LCSC-AF-10-0-Side-insert-3-Have-side-iron-Reverse-PBT-White-plastic-Thicker_C39452.pdf; ComponentLink1Description: Info Page; ComponentLink1URL: https://lcsc.com/product-detail/USB-Connectors_Jing-Extension-of-the-Electronic-Co-LCSC-AF-10-0-Side-insert-3-Have-side-iron-Reverse-PBT-White-plastic-Thicker_C39452.html
J2 = J_microUSB_B_SMD-FCI: CONN RECEPT MICRO USB RA 5POS SMD; Manufacturer: FCI; Manufacturer_No: 10118194
J3 = J_USB_B_2.0_RA: CONN RCPT USB 2.0 TYPE B R/A 4PS; Manufacturer: FCI; Manufacturer_No: 61729-1011BLF; PB-free: Yes; Distributor: Avnet; Dist_No: 61729-1011BLF; Price: 0.34; HelpURL: http://portal.fciconnect.com/Comergent/fci/drawing/61729.pdf; IOT: IOT-0319; Supplier 2: Digi-Key
R1 R11 = Res Semi: Resistor 8.06 kOhm, 1%, 0.1W, 0402; Value: 8k06
R2 R9 = Res Semi: Semiconductor Resistor; Value: 33
R3-R8 R13 R14 = R_10k0_60mW_1_0402_NIC: Resistor, 10.0 kΩ, 1%, 0.06W, 0402; Manufacturer_No: NRC04F1002TRF; Manufacturer: NIC; Value: 10k; HelpURL: http://www.niccomp.com/catalog/nrc.pdf; IOT: IOT-0100
R10 = R_12k0_60mW_1_0402_NIC: Resistor 12.0 kΩ, 1%, 0.06W, 0402; Manufacturer_No: NRC04F1202TRF; Manufacturer: NIC; Value: 12k; HelpURL: http://www.niccomp.com/catalog/nrc.pdf; IOT: IOT-0101
R12 = R_20k0_100mW_1_0603_NIC: Resistor 20 kOhm, 1%, 0.1W, 0603; Manufacturer_No: NRC06F2002TRF; Manufacturer: NIC; PB-free: Yes; Value: 20k; HelpURL: http://www.niccomp.com/catalog/nrc.pdf; Price: 0.0009
S1 = SW_PTS840_RA_SMT: SWITCH SPST RA, 50mA, 24V, SMT; Manufacturer: C&K; Manufacturer_No: PTS840 GKP SMTR LFS; PB-free: Yes; Distributor: Heilind; Dist_No: PTS840 GKP SMTR LFS; HelpURL: http://www.ckswitches.com/media/1477/pts840.pdf; Price: 0.19
TP1 TP2 = TP_50mil-pad: SMD test pin
U1 = U_LPC4357JET256_BGA256: 32-bit ARM Cortex-M4 / M0 Microcontroller, 164 I/O, 1024 KB Flash, 136 KB SRAM, -40 to 105 degC, 256-Ball LBGA, Tray, RoHS; Manufacturer: NXP Semiconductors; RAM: 136 KB; Clock Speed: 204 MHz max.; CAN: 2; Ethernet: 1; Flash: 1024 KB; ComponentLink1URL: www.nxp.com; ComponentLink1Description: Manufacturer URL; ComponentLink2Description: Datasheet; ComponentLink2URL: http://www.nxp.com/documents/data_sheet/LPC435X_3X_2X_1X.pdf; DatasheetVersion: Rev. 5; ComponentLink3URL: http://www.nxp.com/documents/outline_drawing/sot740-2_po.pdf; Code_JEDEC: MO-192; ComponentLink3Description: Package Specification; PartNumber: LPC4357JET256; Packing: Tray; Mounting Technology: Surface Mount; PackageVersion: 05-08-04, 08/2005; PackageDescription: 256-Ball Plastic Low Profile Ball Grid Array Package, Body 17 x 17 mm, Pitch 1 mm; LCD: 1; Core: Cortex-M4; USB: 2; Manufacturer 1: NXP Semiconductors; Manufacturer Part Number 1: LPC4357JET256,551
U2 = U_MT48LC16M16A2F4_VFBGA54: 256Mb PC133 SDR SDRAM, 16Mb x 16, 7.5ns, 3.3V, 0 to 70 degC, 54-Ball VFBGA, Pb-Free; PartNumber: MT48LC16M16A2BG-75; Manufacturer: Micron; Manufacturer 1: Micron Technology; Op. Temp.: 0C to +70C; CL: CL = 3; Clock Rate: 133 MHz; PackageDescription: 54-Ball Fine-Pitch Ball Grid Array, 14 x 8 mm, Pitch 0.8 mm; ComponentLink3Description: Package Specification; Mounting Technology: Surface Mount; PackageVersion: Rev.D; ComponentLink1URL: http://www.micron.com/; ComponentLink3URL: http://www.micron.com/~/media/Documents/Products/Data%20Sheet/DRAM/256Mb_sdr.pdf; Depth: 16Mb; Data Rate: PC133; PackageReference: MICT-BG-54; ComponentLink2URL: http://www.micron.com/~/media/Documents/Products/Data%20Sheet/DRAM/256Mb_sdr.pdf; Cycle Time: 7.5ns; Width: x16; Voltage: 3.3V; ComponentLink1Description: Manufacturer URL; Density: 256Mb; RoHS: Yes; DatasheetVersion: Rev.Q; ComponentLink2Description: Datasheet; Manufacturer Part Number 1: MT48LC16M16A2BG-75
U3 = U_USB3343_QFN24: Enhanced Single Supply Hi-Speed USB ULPI Transceiver, 1.8 to 3.3 V, -40 to 85 degC, 24-Pin QFN, RoHS, Tape and Reel; Manufacturer: Microchip; Number of Transceivers: 1; Operating Supply Voltage (Max): 3.3V; Operating Supply Voltage (Min): 1.8V; Operating Supply Voltage (Typ): 2.5V; ESD Protection: Yes; Dual Supply Voltage (Typ): NotRequiredV; Rad Hardened: No; Operating Temperature (Max): 85C; Package Reference: QFN-24; Package Type: QFNEP; Operating Temperature (Min): -40C; Pin Count: 32; Manufacturer URL: http://www.microchip.com/; Packaging: TapeandReel; Datasheet URL: http://ww1.microchip.com/downloads/en/DeviceDoc/334x.pdf; Mounting: SurfaceMount; Dual Supply Voltage (Min): NotRequiredV; Operating Temperature Classification: Industrial; Package Description: 24-Pin Quad Flat No-lead Package, Body 4 x 4 mm, Pitch 0.5 mm, Thermal Pad 2.5x2.5mm; Datasheet Version: Rev. 1.2, 02/2013; Mounting Technology: SurfaceMount; Dual Supply Voltage (Max): NotRequiredV; Power Supply Requirement: Single; Manufacturer Part Number: USB3343-CP-TR
U4 = U_AP7333-33SAG-7_SOT23-3: IC, CONV DC/DC LDO 3.3V, 300mA, SOT23-3; Manufacturer: STMicroelectronics; Manufacturer_No: LD1117S33CTR; Dist_No: 497-1241-1-ND; PB-free: Yes; IOT: 1039711.0; Distributor: DIGIKEY; HelpURL: http://www.st.com/stonline/products/literature/ds/2572/ld1117xx.pdhttp://www.st.com/stonline/products/literature/ds/2572/ld1117xx.pdf; Price: 0.15; Supplier 1: Digi-Key; Supplier Part Number 1: 497-1241-1-ND; Supplier 2: Digi-Key; Supplier Part Number 2: 497-1241-2-ND; ComponentLink1Description: Datasheet; ComponentLink1URL: https://www.diodes.com/assets/Datasheets/AP7333.pdf
U5 = U_AP2192A_SOIC8: IC, USB Dual Switch w/ 1.5A Current Limit, SOIC-8; Manufacturer: Diodes Inc; Manufacturer_No: AP2152SG-13; ComponentLink1URL: https://www.diodes.com/assets/Datasheets/AP2182A_92A.pdf; ComponentLink1Description: Datasheet; Supplier 1: Digi-Key; Supplier Part Number 1: AP2152SGDICT-ND
X1 = X_13.000MHZ_18pF_3225: X-tal, 13.000MHz, Cl=20pF, +-18ppm, 3225; Manufacturer: ABRACON Co; Manufacturer_No: ABM8G-13.000MHZ-B4Y-T; PB-free: Yes; HelpURL: http://www.abracon.com/Resonators/ABM8G.pdf; Distributor: Future; Dist_No: ABM8G-13.000MHZ-B4Y-T; Price: 0.462; Supplier 1: Digi-Key; Supplier Part Number 1: 535-10285-2-ND
X2 = X_26.000MHZ_6pF_2016: X-tal, 26.000MHz, Cl=6pF, +-18ppm, 2.0 x 1.6mm; Manufacturer: muRata; Manufacturer_No: XRCGB26M000F2P00R0; PB-free: Yes; HelpURL: https://www.murata.com/~/media/webrenewal/support/library/catalog/products/timingdevice/crystalu/p79e.ashx?la=en-us; Distributor: Future; Dist_No: XRCGB26M000F2P00R0; Price: .24; Supplier 1: Digi-Key; Supplier Part Number 1: 490-9764-1-ND; ComponentLink1Description: Datasheet; ComponentLink1URL: https://www.murata.com/~/media/webrenewal/support/library/catalog/products/timingdevice/crystalu/p79e.ashx?la=en-us